# Altium schematic sheet main.SchDoc: Sun Sensor build with digital ALS
size A4; Author: Michał Gumiela; SheetNumber: 1; SheetTotal: 9; PageSetup: Record=PageOptions|CenterHorizontal=True|CenterVertical=True|PrintScale=1.00|XCorrection=1.00|YCorrection=1.00|PrintKind=0|BorderSize=5000000|LeftOffset=0|BottomOffset=0|Orientation=2|PaperLength=1000|PaperWidth=1000|Scale=100|PaperSource=7|PrintQuality=-3|MediaType=1|DitherType=10|PrintScaleMode=1|PaperKind=A4|PaperIndex=9
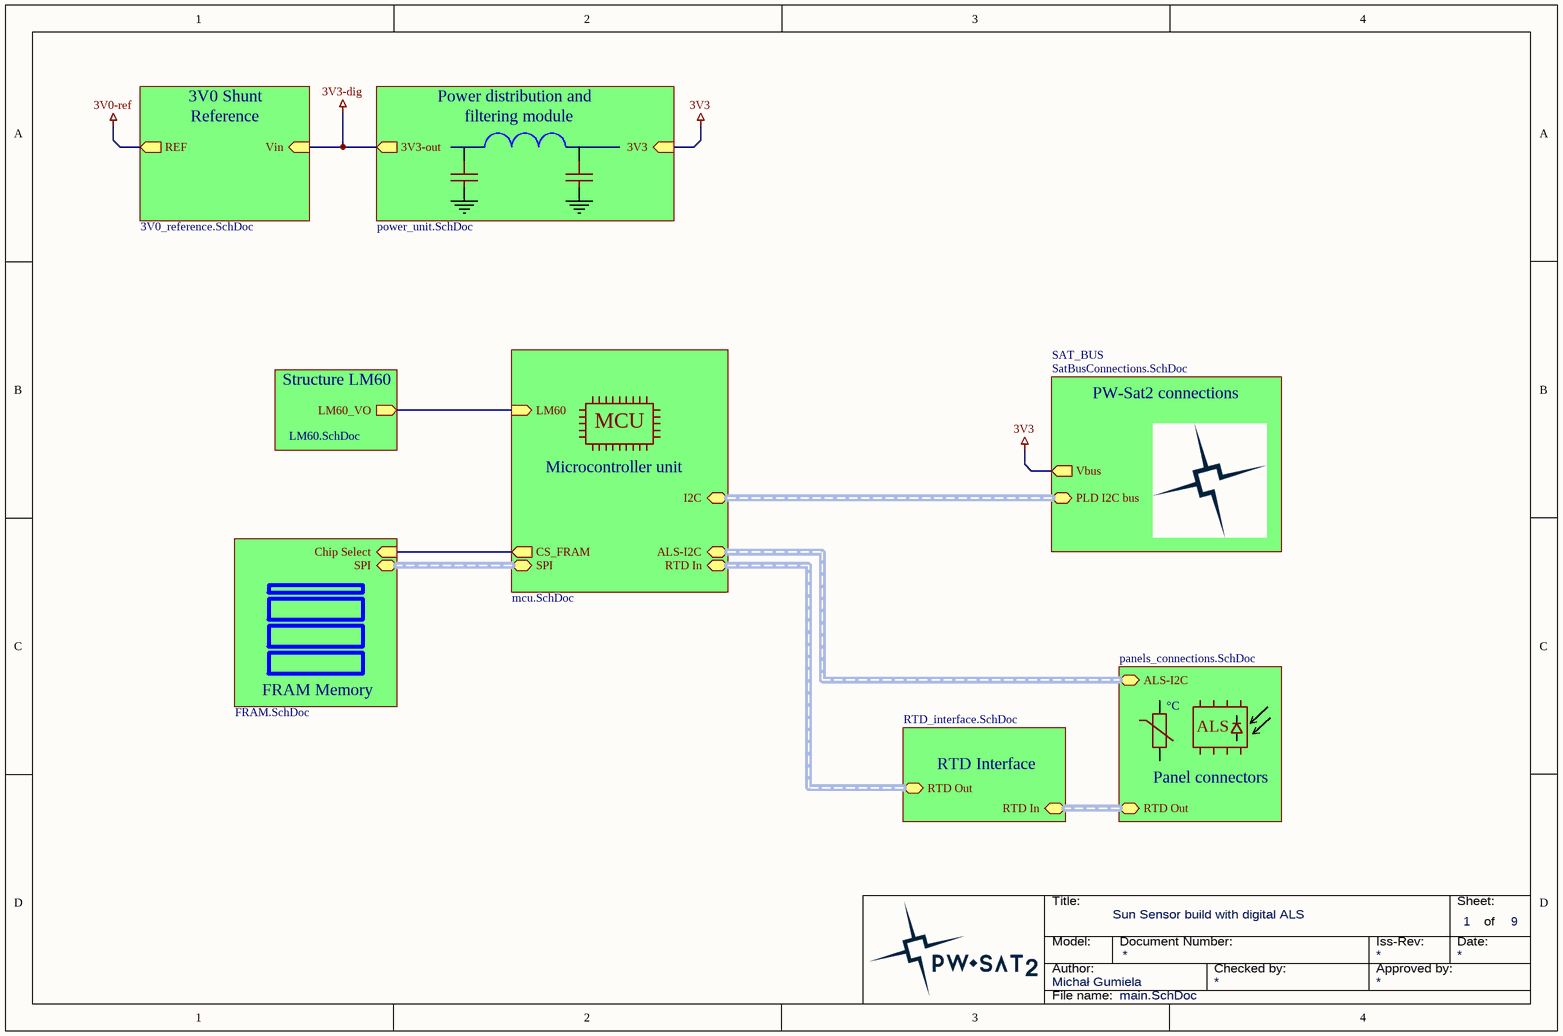
[diagram p0: main.SchDoc]

## Sub-sheets
3.0V Reference = 3V0_reference.SchDoc: Vin (in), REF (out)
FRAM = FRAM.SchDoc: SPI (harness SPI), Chip Select (in)
MCU = mcu.SchDoc: RTD In (harness RTD-DIV), ALS-I2C (harness SOFT-I2C), CS_FRAM (out), SPI (harness SPI), I2C (harness I2C), LM60 (in)
PANELS_CONN = panels_connections.SchDoc: ALS-I2C (harness SOFT-I2C), RTD Out (harness RTD-RAW)
POWER = power_unit.SchDoc: 3V3-out (out), 3V3 (in)
RTD_Interface = RTD_interface.SchDoc: RTD In (harness RTD-RAW), RTD Out (harness RTD-DIV)
SAT_BUS = SatBusConnections.SchDoc: PLD I2C bus (harness I2C), Vbus (out)
Structure LM60 = LM60.SchDoc: LM60_VO (out)

## Nets
3V0-ref: sheet 3.0V Reference/REF
3V3: sheet POWER/3V3, sheet SAT_BUS/Vbus
3V3-dig: sheet POWER/3V3-out, sheet 3.0V Reference/Vin
(unnamed): sheet MCU/CS_FRAM, sheet FRAM/Chip Select
(unnamed): sheet MCU/LM60, sheet Structure LM60/LM60_VO

## Buses and harness runs
harness sheet FRAM/SPI = sheet MCU/SPI
harness sheet MCU/ALS-I2C = sheet PANELS_CONN/ALS-I2C
harness sheet MCU/I2C = sheet SAT_BUS/PLD I2C bus
harness sheet MCU/RTD In = sheet RTD_Interface/RTD Out
harness sheet PANELS_CONN/RTD Out = sheet RTD_Interface/RTD In

## Notes on the sheet
- 3V0 Shunt
- Power distribution and
- Reference
- filtering module
- MCU
- PW-Sat2 connections
- Microcontroller unit
- FRAM Memory
- °C
- RTD Interface
- Panel connectors
- ALS
- Title:
- Sheet:
- of
- Author:
- Model:
- Document Number:
- Checked by:
- Iss-Rev:
- Approved by:
- Date:
- File name: